# EAGLE design M-Brain (EAGLE 7.6.0)
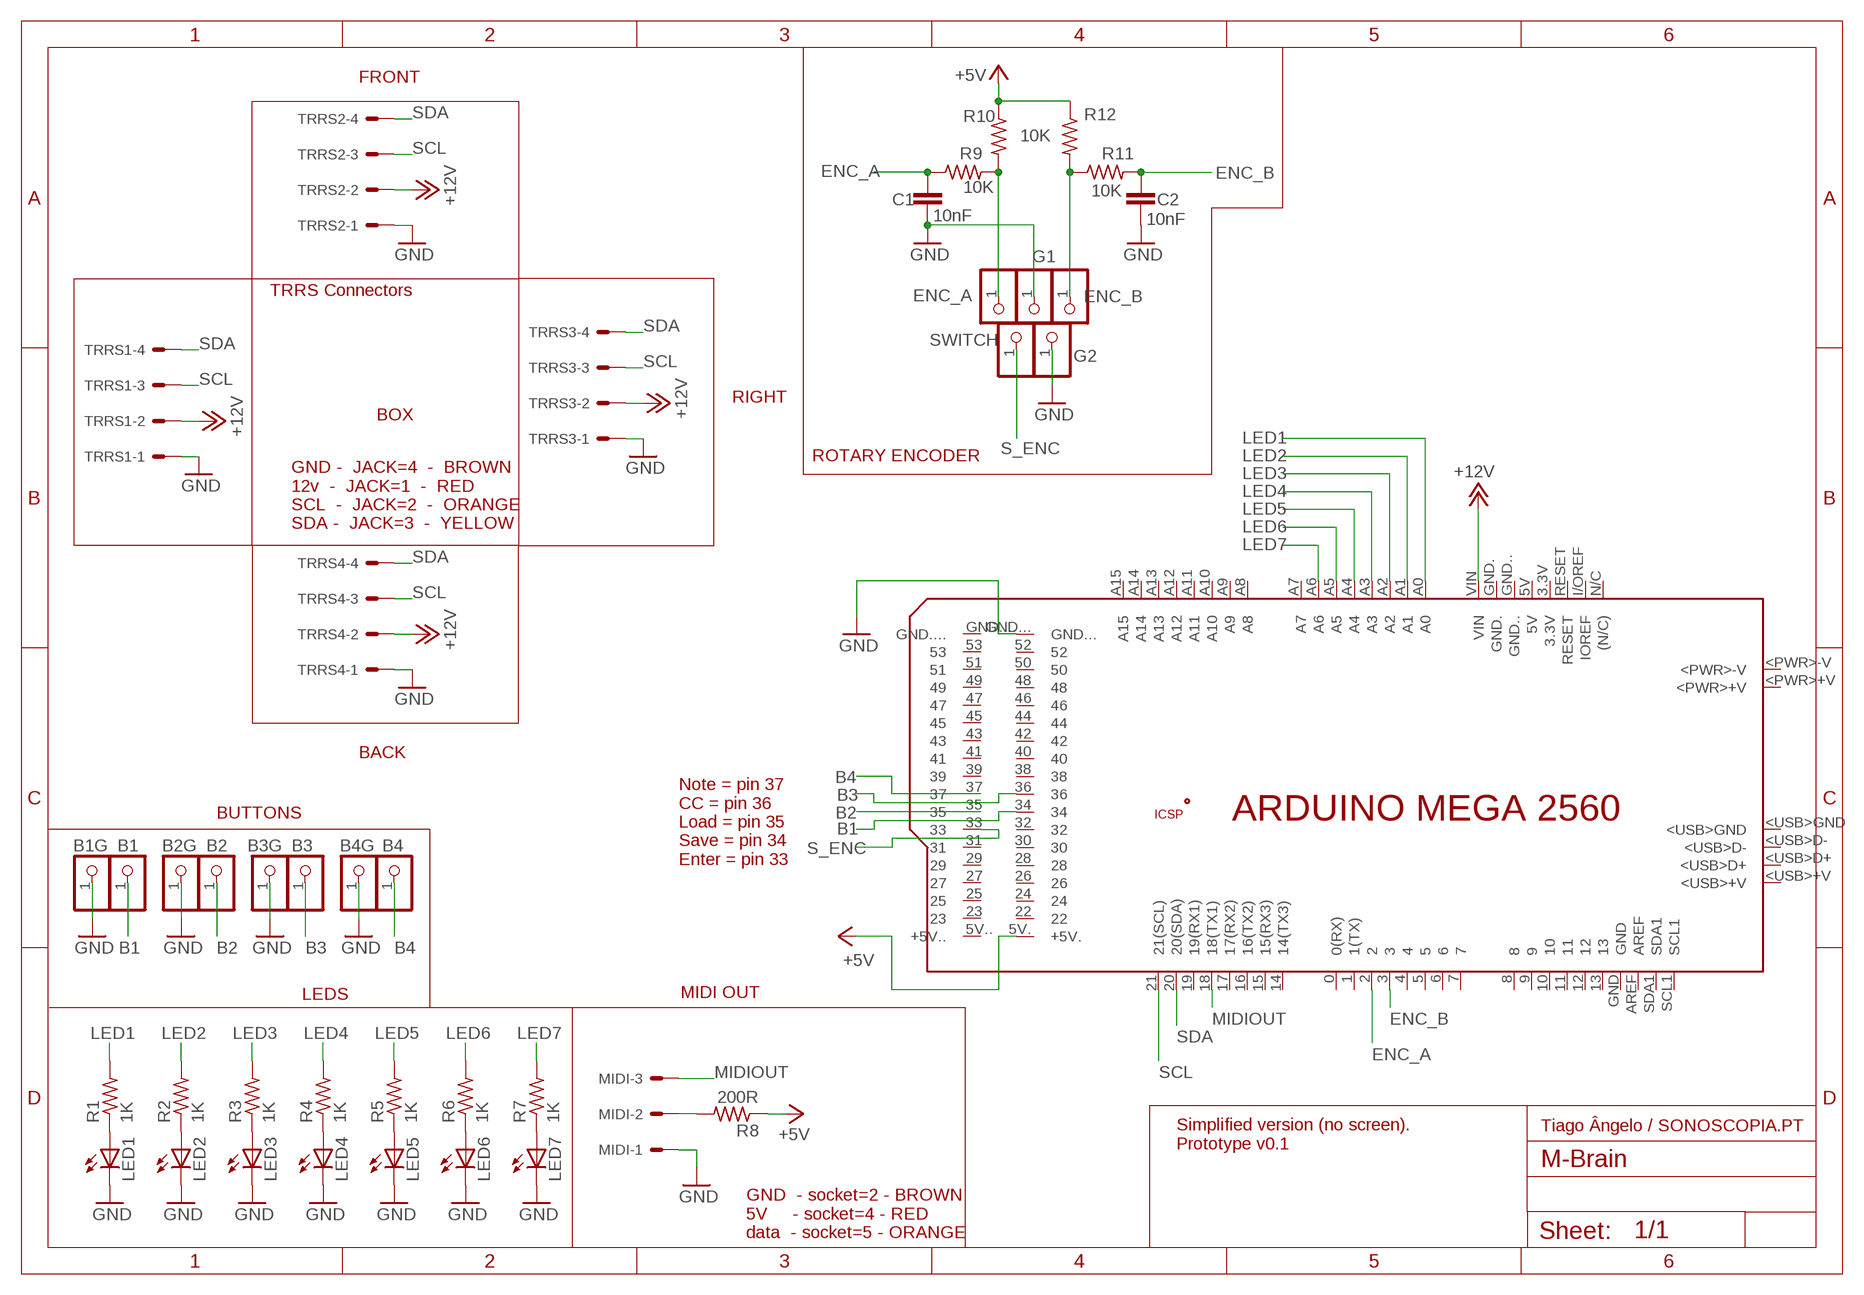
[diagram p0: schematic, sheet 1]

## Parts
B1  PINHD-1X1  [1X01]
B1G  PINHD-1X1  [1X01]
B2  PINHD-1X1  [1X01]
B2G  PINHD-1X1  [1X01]
B3  PINHD-1X1  [1X01]
B3G  PINHD-1X1  [1X01]
B4  PINHD-1X1  [1X01]
B4G  PINHD-1X1  [1X01]
C1  10nF  C2.5/2  [C2.5-2]
C2  10nF  C2.5/2  [C2.5-2]
ENC_A  PINHD-1X1  [1X01]
ENC_B  PINHD-1X1  [1X01]
G1  PINHD-1X1  [1X01]
G2  PINHD-1X1  [1X01]
LED1  LED5MM  [LED5MM]
LED2  LED5MM  [LED5MM]
LED3  LED5MM  [LED5MM]
LED4  LED5MM  [LED5MM]
LED5  LED5MM  [LED5MM]
LED6  LED5MM  [LED5MM]
LED7  LED5MM  [LED5MM]
MIDI  22-27-2031-03  [6410-03]
PCB1  ARDUINO_MEGA2560  [ARDUINO_MEGA2560]
R1  1K  R-US_0204/5  [0204/5]
R2  1K  R-US_0204/5  [0204/5]
R3  1K  R-US_0204/5  [0204/5]
R4  1K  R-US_0204/5  [0204/5]
R5  1K  R-US_0204/5  [0204/5]
R6  1K  R-US_0204/5  [0204/5]
R7  1K  R-US_0204/5  [0204/5]
R8  200R  R-US_0204/7  [0204/7]
R9  10K  R-US_0204/7  [0204/7]
R10  10K  R-US_0204/7  [0204/7]
R11  10K  R-US_0204/7  [0204/7]
R12  10K  R-US_0204/7  [0204/7]
SWITCH  PINHD-1X1  [1X01]
TRRS1  22-27-2041-04  [6410-04]
TRRS2  22-27-2041-04  [6410-04]
TRRS3  22-27-2041-04  [6410-04]
TRRS4  22-27-2041-04  [6410-04]

## Nets
+5V: PCB1.5V.(+5V.) R8.1 R10.1 R12.1
+12V: PCB1.VIN TRRS1.2 TRRS2.2 TRRS3.2 TRRS4.2
B1: B1.1 PCB1.34
B2: B2.1 PCB1.35
B3: B3.1 PCB1.36
B4: B4.1 PCB1.37
ENC_A: C1.1 PCB1.2 R9.1
ENC_B: C2.1 PCB1.3 R11.2
GND: B1G.1 B2G.1 B3G.1 B4G.1 C1.2 C2.2 G1.1 G2.1 LED1.K(C) LED2.K(C) LED3.K(C) LED4.K(C) LED5.K(C) LED6.K(C) LED7.K(C) MIDI.1 PCB1.GND... TRRS1.1 TRRS2.1 TRRS3.1 TRRS4.1
LED1: PCB1.A0 R1.2
LED2: PCB1.A1 R2.2
LED3: PCB1.A2 R3.2
LED4: PCB1.A3 R4.2
LED5: PCB1.A4 R5.2
LED6: PCB1.A5 R6.2
LED7: PCB1.A6 R7.2
MIDIOUT: MIDI.3 PCB1.18(18(TX1))
N$1: LED1.A R1.1
N$2: LED2.A R2.1
N$3: LED3.A R3.1
N$4: LED4.A R4.1
N$5: LED5.A R5.1
N$6: LED6.A R6.1
N$7: LED7.A R7.1
N$8: MIDI.2 R8.2
N$9: ENC_A.1 R9.2 R10.2
N$10: ENC_B.1 R11.1 R12.2
S_ENC: PCB1.33 SWITCH.1
SCL: PCB1.21(21(SCL)) TRRS1.3 TRRS2.3 TRRS3.3 TRRS4.3
SDA: PCB1.20(20(SDA)) TRRS1.4 TRRS2.4 TRRS3.4 TRRS4.4
Unconnected: PCB1.0(0(RX)) PCB1.1(1(TX)) PCB1.3.3V PCB1.4 PCB1.5 PCB1.5V PCB1.5V..(+5V..) PCB1.6 PCB1.7 PCB1.8 PCB1.9 PCB1.10 PCB1.11 PCB1.12 PCB1.13 PCB1.14(14(TX3)) PCB1.15(15(RX3)) PCB1.16(16(TX2)) PCB1.17(17(RX2)) PCB1.19(19(RX1)) PCB1.22 PCB1.23 PCB1.24 PCB1.25 PCB1.26 PCB1.27 PCB1.28 PCB1.29 PCB1.30 PCB1.31 PCB1.32 PCB1.38 PCB1.39 PCB1.40 PCB1.41 PCB1.42 PCB1.43 PCB1.44 PCB1.45 PCB1.46 PCB1.47 PCB1.48 PCB1.49 PCB1.50 PCB1.51 PCB1.52 PCB1.53 PCB1.+5V_ PCB1.<PWR>+V PCB1.<PWR>-V PCB1.<USB>+V PCB1.<USB>D+ PCB1.<USB>D- PCB1.<USB>GND PCB1.A7 PCB1.A8 PCB1.A9 PCB1.A10 PCB1.A11 PCB1.A12 PCB1.A13 PCB1.A14 PCB1.A15 PCB1.AREF PCB1.GND PCB1.GND. PCB1.GND.. PCB1.GND.... PCB1.GND__ PCB1.I/OREF(IOREF) PCB1.MISO PCB1.MOSI PCB1.N/C((N/C)) PCB1.RESET PCB1.RESET. PCB1.SCK PCB1.SCL1 PCB1.SDA1

## Notes on the sheet
- FRONT
- TRRS Connectors
- RIGHT
- BOX
- ROTARY ENCODER
- GND -  JACK=4  -  BROWN
  12v  -  JACK=1  -  RED
  SCL  -  JACK=2  -  ORANGE
  SDA -  JACK=3  -  YELLOW
- BACK
- BUTTONS
- Note = pin 37
  CC = pin 36
  Load = pin 35
  Save = pin 34
  Enter = pin 33
- LEDS | MIDI OUT
- Tiago Ângelo / SONOSCOPIA.PT
- Simplified version (no screen). 
  Prototype v0.1
- GND  - socket=2 - BROWN
  5V     - socket=4 - RED
  data  - socket=5 - ORANGE

## Library data of the parts
B1 B1G B2 B2G B3 B3G B4 B4G ENC_A ENC_B G1 G2 SWITCH = adafruit:PINHD-1X1: Pin header 1x1 for 0.1" spacing With round pins
C1 C2 = capacitor-wima:C: CAPACITOR naming: grid - package width
LED1-LED7 = adafruit:LED: LED OSRAM: - CHIPLED LG R971, LG N971, LY N971, LG Q971, LY Q971, LO R971, LY R971 LH N974, LH R974 LS Q976, LO Q976, LY Q976 LO Q996 - Hyper CHIPLED LW Q18S LB Q993, LB Q99A, LB R99A - SideLED LS A670, LO A670, LY A670, LG A670, LP A670 LB A673, LV A673, LT A673, LW A673 LH A674 LY A675 LS A676, LA A676, LO A676, LY A676, LW A676 LS A679, LY A679, LG A679 - Hyper Micro SIDELED® LS Y876, LA Y876, LO Y876, LY Y876 LT Y87S - SmartLED LW L88C, LW L88S LB L89C, LB L89S, LG L890 LS L89K, LO L89K, LY L89K LS L896, LA L896, LO L896, LY L896 - TOPLED LS T670, LO T670, LY T670, LG T670, LP T670 LSG T670, LSP T670, LSY T670, LOP T670, LYG T670 LG T671, LOG T671, LSG T671 LB T673, LV T673, LT T673, LW T673 LH T674 LS T676, LA T676, LO T676, LY T676, LB T676, LH T676, LSB T676, LW T676 LB T67C, LV T67C, LT T67C, LS T67K, LO T67K, LY T67K, LW E67C LS E67B, LA E67B, LO E67B, LY E67B, LB E67C, LV E67C, LT E67C LW T67C LS T679, LY T679, LG T679 LS T770, LO T770, LY T770, LG T770, LP T770 LB T773, LV T773, LT T773, LW T773 LH T774 LS E675, LA E675, LY E675, LS T675 LS T776, LA T776, LO T776, LY T776, LB T776 LHGB T686 LT T68C, LB T68C - Hyper Mini TOPLED® LB M676 - Mini TOPLED Santana® LG M470 LS M47K, LO M47K, LY M47K Source: http://www.osram.convergy.de/
MIDI = _M-BLOCKS:22-?-03: CONNECTOR wire to board 2.54 mm (.1 inch) pitch header
PCB1 = E14_Arduino_revC:ARDUINO_MEGA2560: Device for representing an Arduino Mega 2560 board with a footprint in an EAGLE design. Created by Dave Young for Element14. More EAGLE documentation at: http://www.element14.com/community/community/knode/cadsoft_eagle
R1-R12 = resistor:R-US_: RESISTOR, American symbol
TRRS1-TRRS4 = _M-BLOCKS:22-?-04: CONNECTOR wire to board 2.54 mm (.1 inch) pitch header

## Board
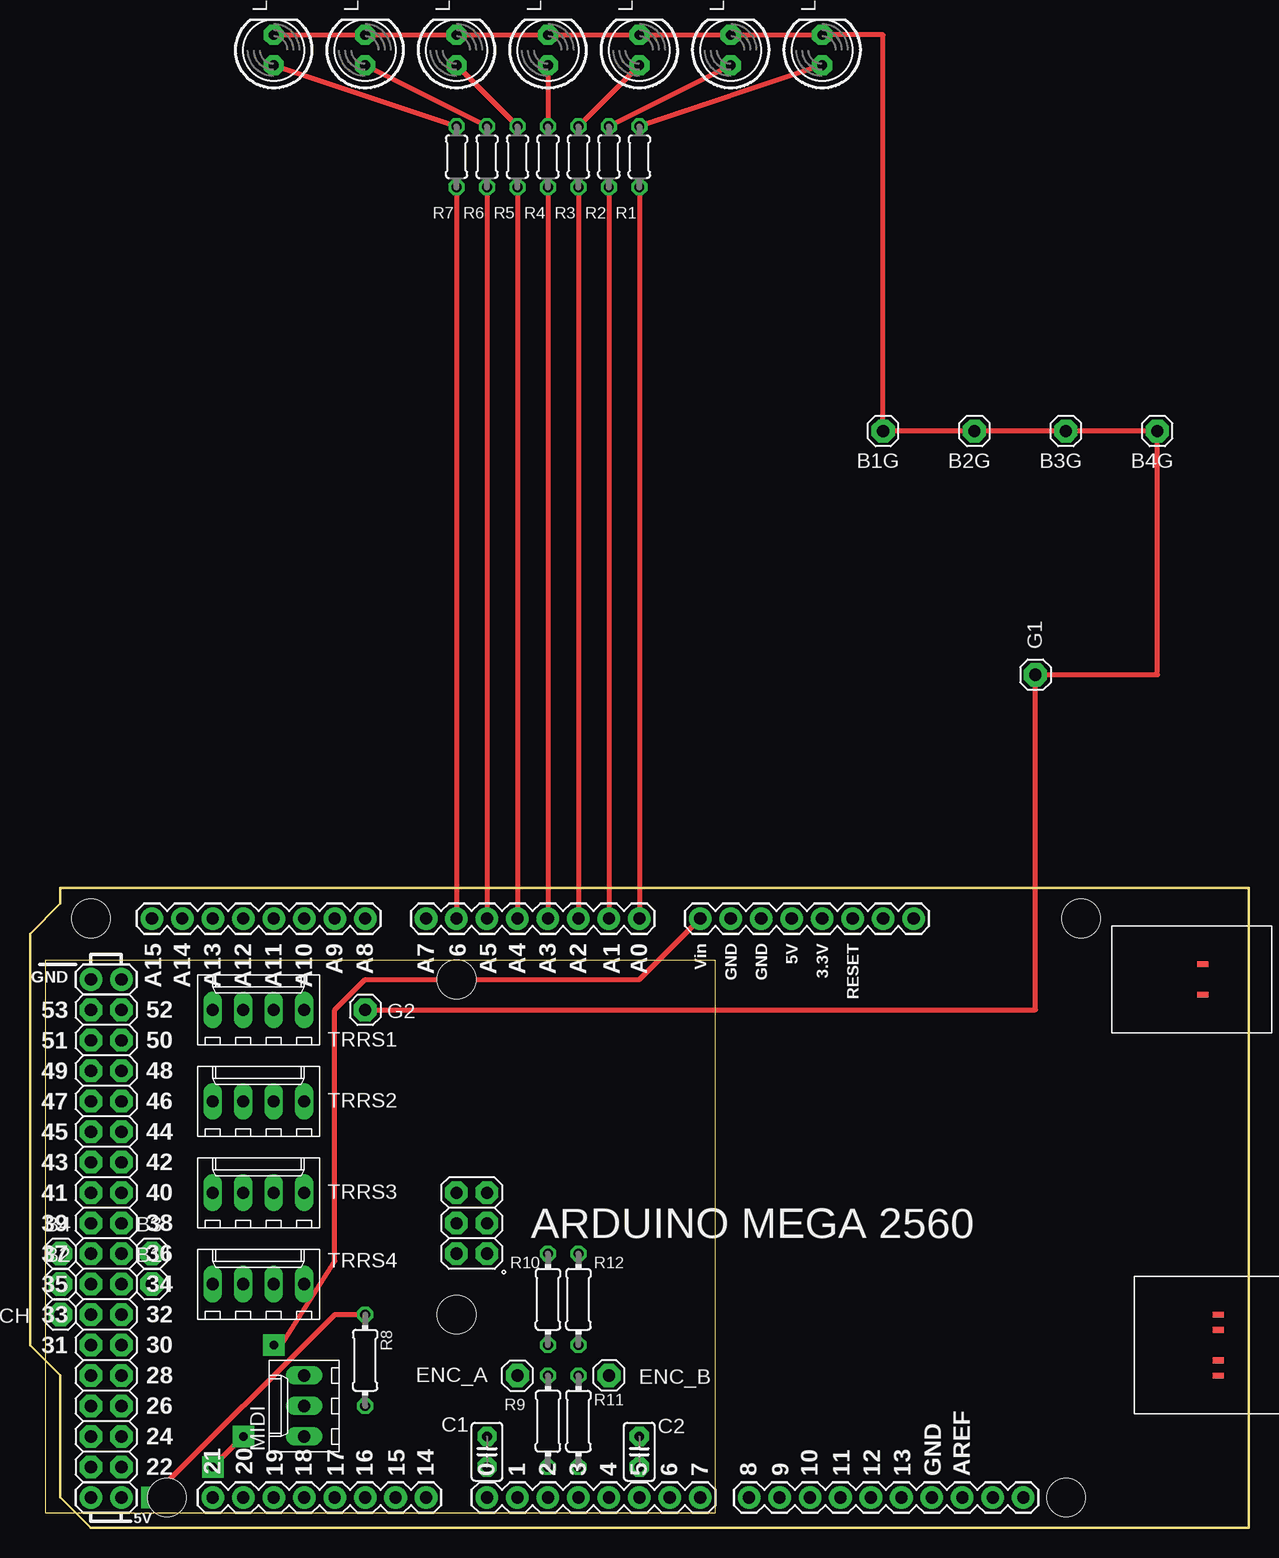
[diagram p1: board, top side]
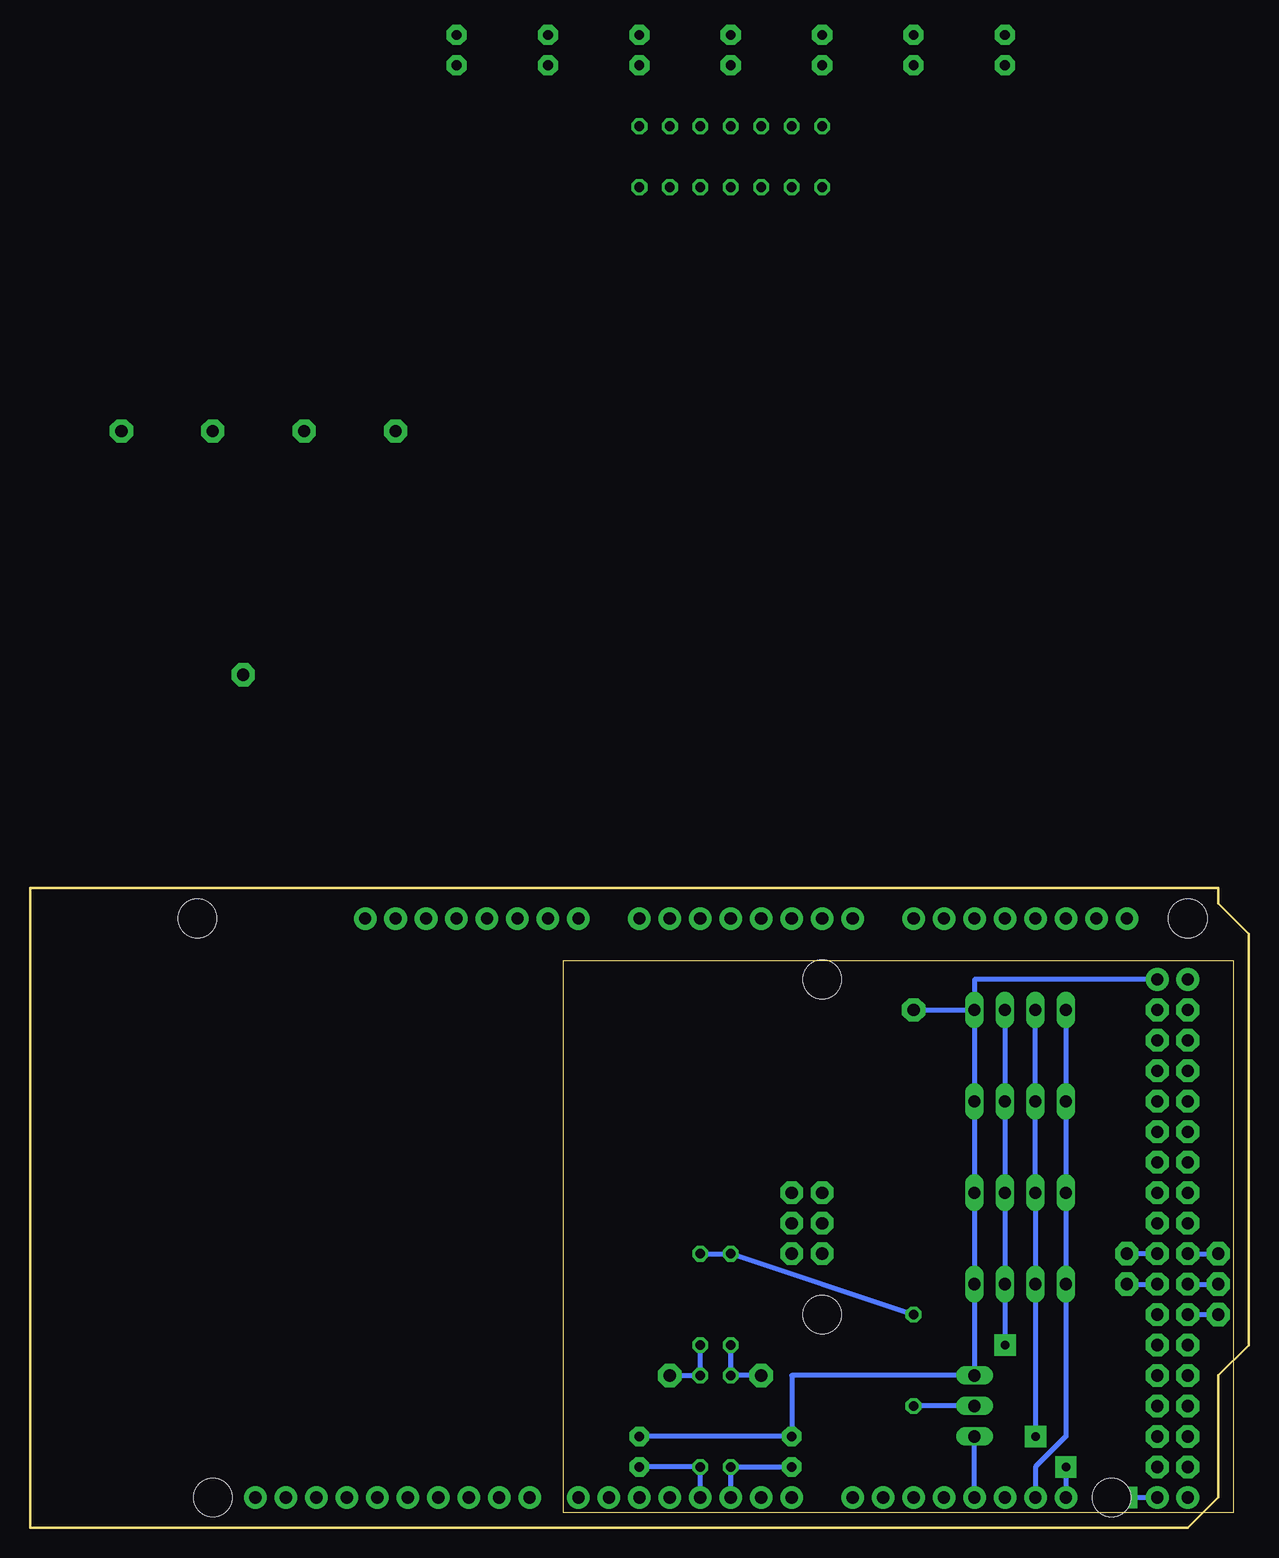
[diagram p2: board, bottom side, seen from below]

Size 101.6 x 53.34 mm. Coordinates in mm from the lower left corner, seen from the top.
Outline: 1.27,1.27 57.13,1.27 57.13,47.3 1.27,47.3 1.27,1.27
Copper layers (1*16): FlyWire 0.035mm / dielectric 1.5mm / VeroBoard 0.035mm
Design rules "default": minimum track width 10mil, minimum drill 24mil, track to track 8mil, track to pad 8mil, pad to pad 8mil, via to via 8mil, smd to smd 8mil, copper to edge 40mil, drill to drill 8mil, minimum pad ring 10mil, minimum via ring 8mil, stop-mask expansion 4mil, vias tented up to drill 0mil, thermal gap 10mil

### Footprints (pad centres in the part's own frame; a part is rotated, then mirrored left to right if it is on the bottom)
1X01 = drill 1.016 pad 1.93 octagon: 1 0,0
C2.5-2 = drill 0.813 pad 1.6 octagon: 1 -1.27,0; 2 1.27,0
LED5MM = drill 0.813 pad 1.676 octagon: A -1.27,0; K 1.27,0
6410-03 = drill 1.016 long: 1 2.54,0; 2 0,0; 3 -2.54,0
ARDUINO_MEGA2560 = drill 1.016 pad 1.88: 0 63.5,50.8; 1 60.96,50.8; 2 58.42,50.8; 3 55.88,50.8; 3.3V 35.56,2.54; 4 53.34,50.8; 5 50.8,50.8; 5V 38.1,2.54; 5V. 93.98,50.8; 5V.. 96.52,50.8; 6 48.26,50.8; 7 45.72,50.8; 8 41.656,50.8; 9 39.116,50.8; 10 36.576,50.8; 11 34.036,50.8; 12 31.496,50.8; 13 28.956,50.8; 14 68.58,50.8; 15 71.12,50.8; 16 73.66,50.8; 17 76.2,50.8; 18 78.74,50.8; 19 81.28,50.8; 20 83.82,50.8; 21 86.36,50.8; A0 50.8,2.54; A1 53.34,2.54; A2 55.88,2.54; A3 58.42,2.54; A4 60.96,2.54; A5 63.5,2.54; A6 66.04,2.54; A7 68.58,2.54; A8 73.66,2.54; A9 76.2,2.54; A10 78.74,2.54; A11 81.28,2.54; A12 83.82,2.54; A13 86.36,2.54; A14 88.9,2.54; A15 91.44,2.54; AREF 23.876,50.8; GND 26.416,50.8; GND. 43.18,2.54; GND.. 40.64,2.54; GND... 93.98,7.62; GND.... 96.52,7.62; I/OREF 30.48,2.54; N/C 27.94,2.54; RESET 33.02,2.54; SCL1 18.796,50.8; SDA1 21.336,50.8; VIN 45.72,2.54 | drill 1.016 pad 1.88 octagon: 22 93.98,48.26; 23 96.52,48.26; 24 93.98,45.72; 25 96.52,45.72; 26 93.98,43.18; 27 96.52,43.18; 28 93.98,40.64; 29 96.52,40.64; 30 93.98,38.1; 31 96.52,38.1; 32 93.98,35.56; 33 96.52,35.56; 34 93.98,33.02; 35 96.52,33.02; 36 93.98,30.48; 37 96.52,30.48; 38 93.98,27.94; 39 96.52,27.94; 40 93.98,25.4; 41 96.52,25.4; 42 93.98,22.86; 43 96.52,22.86; 44 93.98,20.32; 45 96.52,20.32; 46 93.98,17.78; 47 96.52,17.78; 48 93.98,15.24; 49 96.52,15.24; 50 93.98,12.7; 51 96.52,12.7; 52 93.98,10.16; 53 96.52,10.16; +5V_ 66.04,30.48; GND__ 66.04,25.4; MISO 63.5,30.48; MOSI 66.04,27.94; RESET. 63.5,25.4; SCK 63.5,27.94 | smd 1.016 x 0.508: <PWR>+V 3.81,8.89; <PWR>-V 3.81,6.35; <USB>+V 2.54,40.64; <USB>D+ 2.54,39.37; <USB>D- 2.54,36.83; <USB>GND 2.54,35.56 | hole 3.2: 15.24,50.8; 13.97,2.54; 66.04,35.56; 66.04,7.62; 90.17,50.8; 96.52,2.54
0204/5 = drill 0.813 octagon: 1 -2.54,0; 2 2.54,0
0204/7 = drill 0.813 octagon: 1 -3.81,0; 2 3.81,0
6410-04 = drill 1.016 long: 1 3.81,0; 2 1.27,0; 3 -1.27,0; 4 -3.81,0

### Placement (x,y rotation side)
B1  10.16,20.32 0 top
B1G  71.12,91.44 180 top  (outside the outline)
B2  2.54,20.32 0 top
B2G  78.74,91.44 180 top  (outside the outline)
B3  10.16,22.86 0 top
B3G  86.36,91.44 180 top  (outside the outline)
B4  2.54,22.86 0 top
B4G  93.98,91.44 180 top  (outside the outline)
C1  38.1,6.35 90 top
C2  50.8,6.35 90 top
ENC_A  40.64,12.7 90 top
ENC_B  48.26,12.7 270 top
G1  83.82,71.12 0 top  (outside the outline)
G2  27.94,43.18 0 top
LED1  66.04,123.19 90 top  (outside the outline)
LED2  58.42,123.19 90 top  (outside the outline)
LED3  50.8,123.19 90 top  (outside the outline)
LED4  43.18,123.19 90 top  (outside the outline)
LED5  35.56,123.19 90 top  (outside the outline)
LED6  27.94,123.19 90 top  (outside the outline)
LED7  20.32,123.19 90 top  (outside the outline)
MIDI  22.86,10.16 90 top
PCB1  101.6,53.34 180 top
R1  50.8,114.3 270 top  (outside the outline)
R2  48.26,114.3 270 top  (outside the outline)
R3  45.72,114.3 270 top  (outside the outline)
R4  43.18,114.3 270 top  (outside the outline)
R5  40.64,114.3 270 top  (outside the outline)
R6  38.1,114.3 270 top  (outside the outline)
R7  35.56,114.3 270 top  (outside the outline)
R8  27.94,13.97 270 top
R9  43.18,8.89 90 top
R10  43.18,19.05 270 top
R11  45.72,8.89 270 top
R12  45.72,19.05 270 top
SWITCH  2.54,17.78 0 top
TRRS1  19.05,43.18 0 top
TRRS2  19.05,35.56 0 top
TRRS3  19.05,27.94 0 top
TRRS4  19.05,20.32 0 top

### Tracks (layer width: path | path; a pad name or v marks a point on that pad's centre or on a via)
+5V  (via drill 0.7 pad 1.78)
  FlyWire 0.406: 10.16,3.18 v10.16,2.54 25.4,17.78 R8.1
  VeroBoard 0.406: v10.16,2.54 PCB1.5V. | R12.1 R10.1 R8.1
+12V  (via drill 0.7 pad 1.78)
  FlyWire 0.406: v20.32,15.24 20.95,15.24 25.4,22.23 25.4,43.18 27.94,45.72 50.8,45.72 PCB1.VIN
  VeroBoard 0.406: TRRS1.2 TRRS2.2 TRRS3.2 TRRS4.2 v20.32,15.24
B1
  VeroBoard 0.406: B1.1 PCB1.34
B2
  VeroBoard 0.406: PCB1.35 B2.1
B3
  VeroBoard 0.406: PCB1.36 B3.1
B4
  VeroBoard 0.406: PCB1.37 B4.1
ENC_A
  VeroBoard 0.406: PCB1.2 R9.1 C1.1
ENC_B
  VeroBoard 0.406: PCB1.3 R11.2 C2.1
GND
  FlyWire 0.406: G2.1 83.82,43.18 G1.1 93.98,71.12 B4G.1 B3G.1 B2G.1 B1G.1 71.12,124.46 LED1.K LED2.K LED3.K LED4.K LED5.K LED6.K LED7.K
  VeroBoard 0.406: C2.2 C1.2 38.1,12.7 MIDI.1 TRRS4.1 TRRS3.1 TRRS2.1 TRRS1.1 | PCB1.GND... 22.86,45.72 TRRS1.1 | G2.1 TRRS1.1
LED1
  FlyWire 0.406: R1.2 PCB1.A0
LED2
  FlyWire 0.406: R2.2 PCB1.A1
LED3
  FlyWire 0.406: R3.2 PCB1.A2
LED4
  FlyWire 0.406: R4.2 PCB1.A3
LED5
  FlyWire 0.406: R5.2 PCB1.A4
LED6
  FlyWire 0.406: R6.2 PCB1.A5
LED7
  FlyWire 0.406: R7.2 PCB1.A6
MIDIOUT
  VeroBoard 0.406: PCB1.18 MIDI.3
N$1
  FlyWire 0.406: LED1.A R1.1
N$2
  FlyWire 0.406: LED2.A R2.1
N$3
  FlyWire 0.406: LED3.A R3.1
N$4
  FlyWire 0.406: LED4.A R4.1
N$5
  FlyWire 0.406: R5.1 LED5.A
N$6
  FlyWire 0.406: LED6.A R6.1
N$7
  FlyWire 0.406: LED7.A R7.1
N$8
  VeroBoard 0.406: MIDI.2 R8.2
N$9
  VeroBoard 0.406: ENC_A.1 R9.2 R10.2
N$10
  VeroBoard 0.406: ENC_B.1 R11.1 R12.2
S_ENC
  VeroBoard 0.406: SWITCH.1 PCB1.33
SCL  (via drill 0.7 pad 1.78)
  FlyWire 0.406: v17.78,7.62 v15.24,5.08
  VeroBoard 0.406: v17.78,7.62 TRRS4.3 TRRS3.3 TRRS2.3 TRRS1.3 | v15.24,5.08 PCB1.21
SDA
  VeroBoard 0.406: PCB1.20 17.78,5.08 15.24,7.62 TRRS4.4 TRRS3.4 TRRS2.4 TRRS1.4